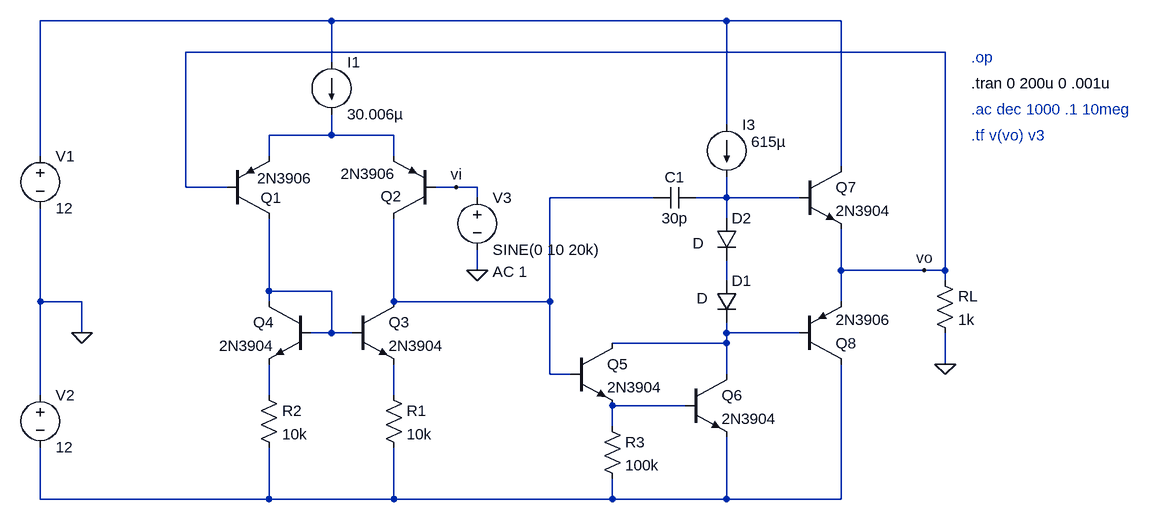
[diagram p0: schematic op_generico_transpar3.asc]
op_generico_transpar3.asc, the LTspice schematic file:
Version 4
SHEET 1 1668 680
WIRE 128 -256 -320 -256
WIRE 736 -256 128 -256
WIRE 912 -256 736 -256
WIRE 1072 -208 -96 -208
WIRE 128 -192 128 -256
WIRE 736 -96 736 -256
WIRE 128 -80 128 -112
WIRE 128 -80 32 -80
WIRE 224 -80 128 -80
WIRE -320 -48 -320 -256
WIRE 32 -48 32 -80
WIRE 224 -48 224 -80
WIRE 912 -32 912 -256
WIRE -96 0 -96 -208
WIRE -32 0 -96 0
WIRE 320 0 288 0
WIRE 352 0 320 0
WIRE 352 16 352 0
WIRE 624 16 464 16
WIRE 736 16 736 -16
WIRE 736 16 688 16
WIRE 848 16 736 16
WIRE 736 48 736 16
WIRE 352 128 352 96
WIRE 912 128 912 64
WIRE 1040 128 912 128
WIRE 1072 128 1072 -208
WIRE 1072 128 1040 128
WIRE 736 144 736 112
WIRE 1072 144 1072 128
WIRE 32 160 32 48
WIRE 128 160 32 160
WIRE -320 176 -320 32
WIRE -256 176 -320 176
WIRE 32 176 32 160
WIRE 224 176 224 48
WIRE 464 176 464 16
WIRE 464 176 224 176
WIRE 912 176 912 128
WIRE -256 224 -256 176
WIRE 128 224 128 160
WIRE 128 224 96 224
WIRE 160 224 128 224
WIRE 736 224 736 208
WIRE 848 224 736 224
WIRE 736 240 736 224
WIRE 736 240 560 240
WIRE 1072 272 1072 224
WIRE 464 288 464 176
WIRE 496 288 464 288
WIRE 736 288 736 240
WIRE -320 320 -320 176
WIRE 32 320 32 272
WIRE 224 320 224 272
WIRE 672 336 560 336
WIRE 560 368 560 336
WIRE -320 480 -320 400
WIRE 32 480 32 400
WIRE 32 480 -320 480
WIRE 224 480 224 400
WIRE 224 480 32 480
WIRE 560 480 560 448
WIRE 560 480 224 480
WIRE 736 480 736 384
WIRE 736 480 560 480
WIRE 912 480 912 272
WIRE 912 480 736 480
FLAG -256 224 0
FLAG 1072 272 0
FLAG 1040 128 vo
FLAG 352 128 0
FLAG 320 0 vi
DATAFLAG 944 128 ""
DATAFLAG 224 112 ""
DATAFLAG 784 16 ""
DATAFLAG 816 224 ""
DATAFLAG 96 -80 ""
SYMBOL npn 496 240 R0
SYMATTR InstName Q5
SYMATTR Value 2N3904
SYMBOL npn 672 288 R0
SYMATTR InstName Q6
SYMATTR Value 2N3904
SYMBOL diode 720 144 R0
WINDOW 3 -30 27 Left 2
SYMATTR InstName D1
SYMBOL diode 720 48 R0
WINDOW 3 -36 38 Left 2
SYMATTR InstName D2
SYMBOL current 736 -96 R0
WINDOW 123 0 0 Left 2
WINDOW 39 0 0 Left 2
WINDOW 3 38 26 Left 2
SYMATTR Value 615µ
SYMATTR InstName I3
SYMBOL npn 848 -32 R0
SYMATTR InstName Q7
SYMATTR Value 2N3904
SYMBOL pnp 848 272 M180
SYMATTR InstName Q8
SYMATTR Value 2N3906
SYMBOL voltage -320 -64 R0
WINDOW 123 0 0 Left 2
WINDOW 39 0 0 Left 2
SYMATTR InstName V1
SYMATTR Value 12
SYMBOL voltage -320 304 R0
WINDOW 123 0 0 Left 2
WINDOW 39 0 0 Left 2
SYMATTR InstName V2
SYMATTR Value 12
SYMBOL res 1056 128 R0
SYMATTR InstName RL
SYMATTR Value 1k
SYMBOL current 128 -192 R0
WINDOW 123 0 0 Left 2
WINDOW 39 0 0 Left 2
SYMATTR InstName I1
SYMATTR Value 30.006µ
SYMBOL pnp -32 48 M180
WINDOW 0 51 32 Left 2
WINDOW 3 46 62 Left 2
SYMATTR InstName Q1
SYMATTR Value 2N3906
SYMBOL pnp 288 48 R180
WINDOW 0 52 34 Left 2
WINDOW 3 61 69 Left 2
SYMATTR InstName Q2
SYMATTR Value 2N3906
SYMBOL npn 160 176 R0
SYMATTR InstName Q3
SYMATTR Value 2N3904
SYMBOL npn 96 176 M0
SYMATTR InstName Q4
SYMATTR Value 2N3904
SYMBOL res 208 304 R0
SYMATTR InstName R1
SYMATTR Value 10k
SYMBOL res 16 304 R0
SYMATTR InstName R2
SYMATTR Value 10k
SYMBOL cap 688 0 R90
WINDOW 0 0 32 VBottom 2
WINDOW 3 32 32 VTop 2
SYMATTR InstName C1
SYMATTR Value 30p
SYMBOL res 544 352 R0
SYMATTR InstName R3
SYMATTR Value 100k
SYMBOL voltage 352 0 R0
WINDOW 123 24 130 Left 2
WINDOW 39 0 0 Left 2
SYMATTR Value2 AC 1
SYMATTR InstName V3
SYMATTR Value SINE(0 10 20k)
TEXT 1112 -200 Left 2 ;.op
TEXT 1112 -120 Left 2 ;.ac dec 1000 .1 10meg
TEXT 1112 -80 Left 2 ;.tf v(vo) v3
TEXT 1112 -160 Left 2 !.tran 0 200u 0 .001u

The netlist it stands for:
* op_generico_transpar3.asc
Q5 N007 N003 N010 0 2N3904
Q6 N007 N010 N011 0 2N3904
D1 N005 N007 D
D2 N004 N005 D
I3 N001 N004 615µ
Q7 N001 N004 vo 0 2N3904
Q8 N011 N007 vo 0 2N3906
V1 N001 0 12
V2 0 N011 12
RL vo 0 1k
I1 N001 N002 30.006µ
Q1 N006 vo N002 0 2N3906
Q2 N003 vi N002 0 2N3906
Q3 N003 N006 N009 0 2N3904
Q4 N006 N006 N008 0 2N3904
R1 N009 N011 10k
R2 N008 N011 10k
C1 N004 N003 30p
R3 N010 N011 100k
V3 vi 0 SINE(0 10 20k) AC 1
.model D D
.lib standard.dio
.model NPN NPN
.model PNP PNP
.lib standard.bjt
* .op
* .ac dec 1000 .1 10meg
* .tf v(vo) v3
.tran 0 200u 0 .001u
.backanno
.end